# Altium schematic sheet UserInterface.SchDoc: Title
size A4; SchTemplateVer: V2.0; Author: Adam Mizerkiewicz; CompanyName: Adam Mizerkiewicz; DrawnBy: Adam Mizerkiewicz; Engineer: Adam Mizerkiewicz; Organization: Adam Mizerkiewicz; Address1: Sarnia 2/19; Address2: 61-058 Poznań; Revision: 0.0
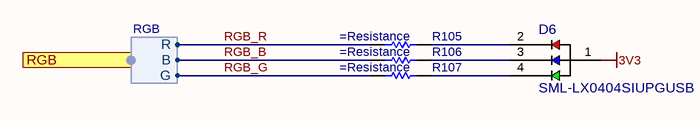
[diagram p0: UserInterface.SchDoc]

## Parts
D6  SML-LX0404SIUPGUSB  [LED_SML-LX0404_LUM]
R105  (no value)  [R0402]
R106  (no value)  [R0402]
R107  (no value)  [R0402]

## Ports
RGB (harness RGB)

## Harnesses
RGB: R, G, B

## Nets
3V3: D6.1(A)
RGB_B: R106.1 ; port RGB.B
RGB_G: R107.1 ; port RGB.G
RGB_R: R105.1 ; port RGB.R
NetD6_2: D6.2(R) R105.2
NetD6_3: D6.3(B) R106.2
NetD6_4: D6.4(G) R107.2

## Notes on the sheet
- Revision
  =Revision
- Sheet
  =SheetNumber / =SheetTotal

## Library data of the parts
D6 = SML-LX0404SIUPGUSB: LED Tri-Color Blue/Green/Red 468nm/518nm/632nm 4-Pin SMD T/R; Manufacturer: Lumex; Color: Blue, Green, Red; Forward Current: 30mA; Forward Voltage: 2.73V; Lens Color: Clear, Colorless; Lens Style: Clear, Rectangular, Square; Lens Transparency: Clear; Luminous Intensity: 20mcd; Number of Circuits: 1; Number of LEDs: 3; Power Rating: 30mW; Reverse Voltage: 5V; Shape: Square; Test Current: 2mA; Viewing Angle: 120°; Wavelength: 465nm; Supplier 1: DigiKey; Supplier Part Number 1: 67-2125-1-ND; Supplier: DigiKey; Supplier Part Number: 67-2125-1-ND; Manufacturer Part Number: SML-LX0404SIUPGUSB; RoHS: Compliant; Category: LEDs; Stock: 85374; Pricing: 1=1,06, 10=0,743, 100=0,5504, 500=0,4646, 1000=0,43654 (USD); Case/Package: 0404; Case Code (Imperial): 0404; Case Code (Metric): 1010; China RoHS: Compliant; Height: 250µm; Lead Free: Lead Free; Length: 1mm; Lifecycle Status: Production; Max Operating Temperature: 85°C; Min Operating Temperature: -40°C; Mounting Technology: Surface Mount; Number of Terminals: 4; Packaging: Cut Tape; REACH SVHC: Yes; Schedule B: 8541402000; Width: 1mm; ComponentLink1URL: https://datasheet.octopart.com:443/SML-LX0404SIUPGUSB-Lumex-datasheet-180611911.pdf?src-supplier=IHS; ComponentLink1Description: https://datasheet.octopart.com:443/SML-LX0404SIUPGUSB-Lumex-datasheet-180611911.pdf?src-supplier=IHS; ComponentLink2URL: https://datasheet.octopart.com:443/SML-LX0404SIUPGUSB-Lumex-datasheet-43153159.pdf?src-supplier=Upverter; ComponentLink2Description: https://datasheet.octopart.com:443/SML-LX0404SIUPGUSB-Lumex-datasheet-43153159.pdf?src-supplier=Upverter; ComponentLink3URL: https://datasheet.octopart.com:443/SML-LX0404SIUPGUSB-Lumex-datasheet-21230143.pdf?src-supplier=element14+APAC; ComponentLink3Description: https://datasheet.octopart.com:443/SML-LX0404SIUPGUSB-Lumex-datasheet-21230143.pdf?src-supplier=element14+APAC; ComponentLink4URL: https://datasheet.octopart.com:443/SML-LX0404SIUPGUSB-Lumex-datasheet-28835211.pdf?src-supplier=element14+APAC; ComponentLink4Description: https://datasheet.octopart.com:443/SML-LX0404SIUPGUSB-Lumex-datasheet-28835211.pdf?src-supplier=element14+APAC; ComponentLink5URL: https://datasheet.octopart.com:443/SML-LX0404SIUPGUSB-Lumex-datasheet-62120010.pdf?src-supplier=Master+Electronics; ComponentLink5Description: https://datasheet.octopart.com:443/SML-LX0404SIUPGUSB-Lumex-datasheet-62120010.pdf?src-supplier=Master+Electronics; ComponentLink6URL: https://datasheet.octopart.com:443/SML-LX0404SIUPGUSB-Lumex-datasheet-139013812.pdf?src-supplier=TME; ComponentLink6Description: https://datasheet.octopart.com:443/SML-LX0404SIUPGUSB-Lumex-datasheet-139013812.pdf?src-supplier=TME; ComponentLink7URL: https://datasheet.octopart.com:443/SML-LX0404SIUPGUSB-Lumex-datasheet-33469811.pdf?src-supplier=RS+(Formerly+Allied+Electronics); ComponentLink7Description: https://datasheet.octopart.com:443/SML-LX0404SIUPGUSB-Lumex-datasheet-33469811.pdf?src-supplier=RS+(Formerly+Allied+Electronics); ComponentLink8URL: https://datasheet.octopart.com:443/SML-LX0404SIUPGUSB-Lumex-datasheet-12537431.pdf?src-supplier=Future+Electronics; ComponentLink8Description: https://datasheet.octopart.com:443/SML-LX0404SIUPGUSB-Lumex-datasheet-12537431.pdf?src-supplier=Future+Electronics
R105 = RES0402-680-1%: Res Thick Film 0402 680 Ohm 1% 0.063W(1/16W) ±100ppm/C Pad SMD T/R; Manufacturer: Vishay; Manufacturer Part Number: CRCW0402680RFKEDC; Resistance: 680Ω; Power Dissipation: 63mW; Value: 680Ω; Temperature Coefficient: 100ppm/°C; Working Voltage: 50V; Supplier 1: DigiKey; Supplier Part Number 1: 541-4073-1-ND; Supplier: DigiKey; Supplier Part Number: 541-4073-1-ND; RoHS: Compliant; Category: Chip SMD Resistors; Stock: 206901; Pricing: 1=0,1, 10=0,028, 25=0,0208, 50=0,0168, 100=0,0138, 250=0,01072, 500=0,009, 1000=0,00766, 5000=0,00554 (USD); Case/Package: 0402; China RoHS: Non-Compliant; Height: 300µm; Lead Free: Lead Free; Lifecycle Status: Production; Max Operating Temperature: 155°C; Min Operating Temperature: -55°C; Mounting Technology: Surface Mount; Number of Terminals: 2; Power Rating: 63mW; REACH SVHC: Yes; Schedule B: 8533210045, 8533210045|8533210045|8533210045|8533210045|8533210045; Tolerance: 1%; Width: 500µm; ComponentLink1URL: https://datasheet.octopart.com:443/CRCW0402680RFKEDC-Vishay-datasheet-175423585.pdf?src-supplier=IHS; ComponentLink1Description: https://datasheet.octopart.com:443/CRCW0402680RFKEDC-Vishay-datasheet-175423585.pdf?src-supplier=IHS; ComponentLink2URL: https://datasheet.octopart.com:443/CRCW0402680RFKEDC-Vishay-datasheet-102570912.pdf?src-supplier=Future+Electronics; ComponentLink2Description: https://datasheet.octopart.com:443/CRCW0402680RFKEDC-Vishay-datasheet-102570912.pdf?src-supplier=Future+Electronics; ComponentLink3URL: https://datasheet.octopart.com:443/CRCW0402680RFKEDC-Vishay-datasheet-62316122.pdf?src-supplier=Future+Electronics; ComponentLink3Description: https://datasheet.octopart.com:443/CRCW0402680RFKEDC-Vishay-datasheet-62316122.pdf?src-supplier=Future+Electronics; ComponentLink4URL: http://sigma.octopart.com:80/rohs_statement/Vishay-company-15.pdf?src-supplier=Compliance+Statements; ComponentLink4Description: http://sigma.octopart.com:80/rohs_statement/Vishay-company-15.pdf?src-supplier=Compliance+Statements
R106 R107 = RES0402-300-1%: Fixed Resistor, Metal Glaze/thick Film, 0.063W, 300ohm, 50V, 1% +/-Tol, 100ppm/Cel, Surface Mount, 0402; Manufacturer: Vishay; Manufacturer Part Number: CRCW0402300RFKTD; Resistance: 300Ω; Max Power Dissipation: 63mW; Value: 300Ω; Temperature Coefficient: 100ppm/°C; Supplier 1: DigiKey; Supplier Part Number 1: CRCW0402300RFKTD-ND; Supplier: DigiKey; Supplier Part Number: CRCW0402300RFKTD-ND; Category: Chip SMD Resistors; Pricing: 10000=0,0229 (USD); Case/Package: 0402; Case Code (Metric): 0402; Composition: Thick Film; Contact Plating: Lead, Tin; Depth: 500µm; Features: Automotive AEC-Q200; Height: 350µm; Lead Free: Contains Lead; Length: 990.6µm; Lifecycle Status: Production; Max Operating Temperature: 155°C; Military Standard: Not; Min Operating Temperature: -55°C; Mounting Technology: Surface Mount; Number of Terminals: 2; Number of Terminations: 2; Packaging: Tape & Reel (TR); Power Dissipation: 63mW; Power Rating: 63mW; Radiation Hardening: No; REACH SVHC: No; RoHS: Non-Compliant; Tolerance: 1%; Voltage Rating (DC): 50V; Width: 500µm; Working Voltage: 50V; ComponentLink1URL: https://datasheet.octopart.com:443/CRCW0402300RFKTD-Vishay-datasheet-175863636.pdf?src-supplier=IHS; ComponentLink1Description: https://datasheet.octopart.com:443/CRCW0402300RFKTD-Vishay-datasheet-175863636.pdf?src-supplier=IHS; ComponentLink2URL: https://datasheet.octopart.com:443/CRCW0402300RFKTD-Vishay-datasheet-182027442.pdf?src-supplier=IHS; ComponentLink2Description: https://datasheet.octopart.com:443/CRCW0402300RFKTD-Vishay-datasheet-182027442.pdf?src-supplier=IHS; ComponentLink3URL: https://datasheet.octopart.com:443/CRCW0402300RFKTD-Vishay-datasheet-183883876.pdf?src-supplier=Newark; ComponentLink3Description: https://datasheet.octopart.com:443/CRCW0402300RFKTD-Vishay-datasheet-183883876.pdf?src-supplier=Newark; ComponentLink4URL: https://datasheet.octopart.com/D-CRCW-Lead-%28Pb%29-Bearing-Thick-Film%2C-Rectangular-Chip-Resistors-Vishay-datasheet-family-72.pdf; ComponentLink4Description: https://datasheet.octopart.com/D-CRCW-Lead-%28Pb%29-Bearing-Thick-Film%2C-Rectangular-Chip-Resistors-Vishay-datasheet-family-72.pdf; ComponentLink5URL: https://datasheet.octopart.com/CRCW0402300RFKTD-Vishay-datasheet-13242068.pdf; ComponentLink5Description: https://datasheet.octopart.com/CRCW0402300RFKTD-Vishay-datasheet-13242068.pdf; ComponentLink6URL: https://datasheet.octopart.com/CRCW0402300RFKTD-Vishay-datasheet-13195083.pdf; ComponentLink6Description: https://datasheet.octopart.com/CRCW0402300RFKTD-Vishay-datasheet-13195083.pdf; ComponentLink7URL: https://datasheet.octopart.com/CRCW0402300RFKTD-Vishay-datasheet-13034211.pdf; ComponentLink7Description: https://datasheet.octopart.com/CRCW0402300RFKTD-Vishay-datasheet-13034211.pdf; ComponentLink8URL: https://datasheet.octopart.com/CRCW0402300RFKTD-Vishay-datasheet-12600034.pdf; ComponentLink8Description: https://datasheet.octopart.com/CRCW0402300RFKTD-Vishay-datasheet-12600034.pdf; ComponentLink9URL: https://datasheet.octopart.com/CRCW0402300RFKTD-Vishay-datasheet-12532161.pdf; ComponentLink9Description: https://datasheet.octopart.com/CRCW0402300RFKTD-Vishay-datasheet-12532161.pdf; ComponentLink10URL: https://datasheet.octopart.com/CRCW0402300RFKTD-Vishay-datasheet-12517896.pdf; ComponentLink10Description: https://datasheet.octopart.com/CRCW0402300RFKTD-Vishay-datasheet-12517896.pdf; ComponentLink11URL: https://datasheet.octopart.com/CRCW0402300RFKTD-Vishay-datasheet-12509762.pdf; ComponentLink11Description: https://datasheet.octopart.com/CRCW0402300RFKTD-Vishay-datasheet-12509762.pdf; ComponentLink12URL: https://datasheet.octopart.com/CRCW0402300RFKTD-Vishay-datasheet-10322335.pdf; ComponentLink12Description: https://datasheet.octopart.com/CRCW0402300RFKTD-Vishay-datasheet-10322335.pdf; ComponentLink13URL: https://datasheet.octopart.com/CRCW0402300RFKTD-Vishay-datasheet-8788789.pdf; ComponentLink13Description: https://datasheet.octopart.com/CRCW0402300RFKTD-Vishay-datasheet-8788789.pdf; ComponentLink14URL: https://datasheet.octopart.com/CRCW0402300RFKTD-Vishay-datasheet-8361388.pdf; ComponentLink14Description: https://datasheet.octopart.com/CRCW0402300RFKTD-Vishay-datasheet-8361388.pdf; ComponentLink15URL: https://datasheet.octopart.com/CRCW0402300RFKTD-Vishay-datasheet-5306405.pdf; ComponentLink15Description: https://datasheet.octopart.com/CRCW0402300RFKTD-Vishay-datasheet-5306405.pdf; ComponentLink16URL: https://datasheet.octopart.com/CRCW0402300RFKTD-Vishay-datasheet-546287.pdf; ComponentLink16Description: https://datasheet.octopart.com/CRCW0402300RFKTD-Vishay-datasheet-546287.pdf; ComponentLink17URL: http://sigma.octopart.com:80/rohs_statement/Vishay-company-15.pdf?src-supplier=Compliance+Statements; ComponentLink17Description: http://sigma.octopart.com:80/rohs_statement/Vishay-company-15.pdf?src-supplier=Compliance+Statements